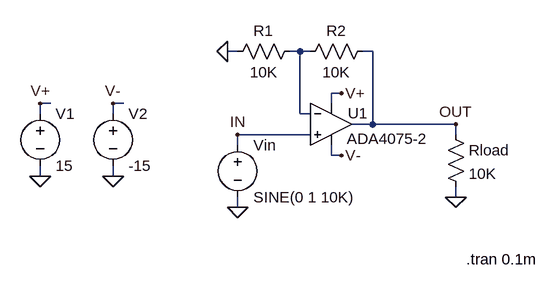
[diagram p0: schematic ADA4075-2.asc]
ADA4075-2.asc, the LTspice schematic file:
Version 4.1
SHEET 1 1240 700
WIRE 432 -1216 416 -1216
WIRE 528 -1216 512 -1216
WIRE 544 -1216 528 -1216
WIRE 640 -1216 624 -1216
WIRE 592 -1152 576 -1152
WIRE 144 -1136 128 -1136
WIRE 256 -1136 240 -1136
WIRE 576 -1136 576 -1152
WIRE 128 -1120 128 -1136
WIRE 240 -1120 240 -1136
WIRE 528 -1120 528 -1216
WIRE 544 -1120 528 -1120
WIRE 640 -1104 640 -1216
WIRE 640 -1104 608 -1104
WIRE 768 -1104 640 -1104
WIRE 544 -1088 432 -1088
WIRE 768 -1088 768 -1104
WIRE 432 -1072 432 -1088
WIRE 576 -1056 576 -1072
WIRE 592 -1056 576 -1056
WIRE 128 -1024 128 -1040
WIRE 240 -1024 240 -1040
WIRE 768 -992 768 -1008
WIRE 432 -976 432 -992
FLAG 128 -1136 V+
FLAG 432 -976 0
FLAG 768 -1104 OUT
FLAG 432 -1088 IN
FLAG 592 -1152 V+
FLAG 240 -1136 V-
FLAG 592 -1056 V-
FLAG 416 -1216 0
FLAG 768 -992 0
FLAG 240 -1024 0
FLAG 128 -1024 0
SYMBOL voltage 128 -1136 R0
WINDOW 123 0 0 Left 2
WINDOW 39 0 0 Left 2
SYMATTR InstName V1
SYMATTR Value 15
SYMBOL voltage 432 -1088 R0
WINDOW 123 24 146 Left 2
WINDOW 39 24 125 Left 2
SYMATTR InstName Vin
SYMATTR Value SINE(0 1 10K)
SYMBOL res 528 -1232 R90
WINDOW 0 0 56 VBottom 2
WINDOW 3 32 56 VTop 2
SYMATTR InstName R1
SYMATTR Value 10K
SYMBOL res 640 -1232 R90
WINDOW 0 0 56 VBottom 2
WINDOW 3 32 56 VTop 2
SYMATTR InstName R2
SYMATTR Value 10K
SYMBOL voltage 240 -1136 R0
WINDOW 123 24 146 Left 2
WINDOW 39 24 125 Left 2
SYMATTR InstName V2
SYMATTR Value -15
SYMBOL res 752 -1104 R0
SYMATTR InstName Rload
SYMATTR Value 10K
SYMBOL ADA4075-2 576 -1168 R0
WINDOW 0 26 47 Left 2
WINDOW 3 24 86 Left 2
SYMATTR InstName U1
TEXT 784 -896 Left 2 !.tran 0.1m

The netlist it stands for:
* ADA4075-2.asc
V1 V+ 0 15
Vin IN 0 SINE(0 1 10K)
R1 N001 0 10K
R2 OUT N001 10K
V2 V- 0 -15
Rload OUT 0 10K
* U1: ADA4075-2 (symbol ADA4075-2 not available, pins judged from their places): In+=IN In-=N001 V+=V+ V-=V- OUT=OUT
.tran 0.1m
.backanno
.end